# EAGLE design pecl_pulse_driver (EAGLE 9.2.2)
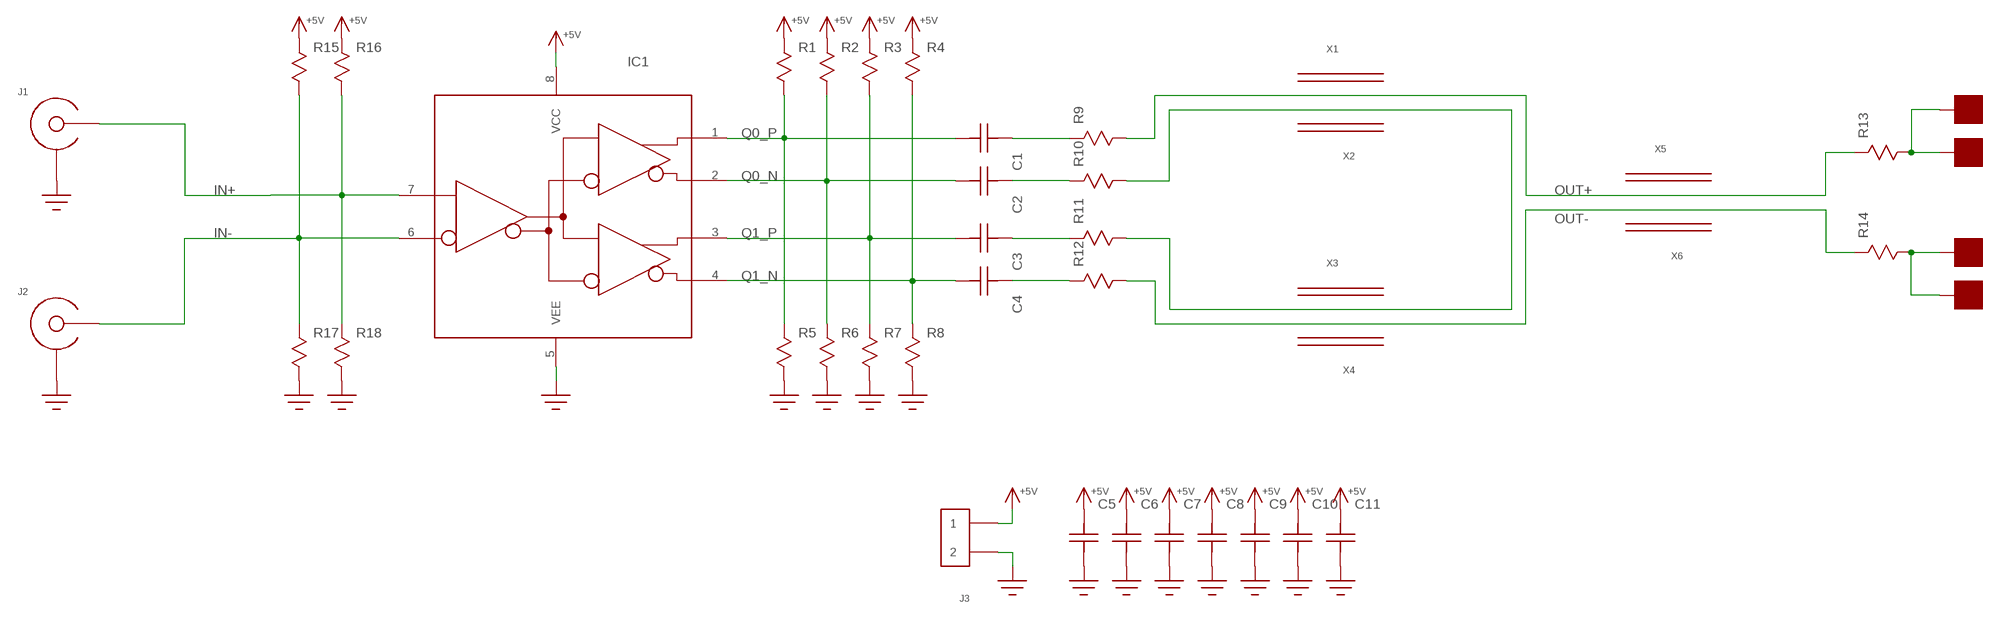
[diagram p0: schematic, sheet 1]

## Parts
C1  C0603  [C0603]
C2  C0603  [C0603]
C3  C0603  [C0603]
C4  C0603  [C0603]
C5  C0603  [C0603]
C6  C0603  [C0603]
C7  C0805  [0805]
C8  C0603  [C0603]
C9  C0603  [C0603]
C10  C0603  [C0603]
C11  C0603  [C0603]
IC1  SY10EP89V  [SOIC8]
J1  EDGE_LAUNCH_JACK  [EDGE_LAUNCH_RF_CON]
J2  EDGE_LAUNCH_JACK  [EDGE_LAUNCH_RF_CON]
J3  HEADER_2PIN  [HEADER_2PIN]
R1  R0603  [R0603]
R2  R0603  [R0603]
R3  R0603  [R0603]
R4  R0603  [R0603]
R5  R0603  [R0603]
R6  R0603  [R0603]
R7  R0603  [R0603]
R8  R0603  [R0603]
R9  R0603  [R0603]
R10  R0603  [R0603]
R11  R0603  [R0603]
R12  R0603  [R0603]
R13  R0603  [R0603]
R14  R0603  [R0603]
R15  R0603  [R0603]
R16  R0603  [R0603]
R17  R0603  [R0603]
R18  R0603  [R0603]
U$4  PAD50MIL  [PAD_50MIL]
U$5  PAD50MIL  [PAD_50MIL]
U$35  PAD50MIL  [PAD_50MIL]
U$36  PAD50MIL  [PAD_50MIL]
X1  FERRITE_PLATE  [FERRITE-MP0350]
X2  FERRITE_PLATE  [FERRITE-MP0350]
X3  FERRITE_PLATE  [FERRITE-MP0350]
X4  FERRITE_PLATE  [FERRITE-MP0350]
X5  FERRITE_PLATE  [FERRITE-MP0350]
X6  FERRITE_PLATE  [FERRITE-MP0350]

## Nets
+5V: C5.P$2 C6.P$2 C7.P$2 C8.P$2 C9.P$2 C10.P$2 C11.P$2 IC1.8(VCC) J3.1 R1.P$1 R2.P$1 R3.P$1 R4.P$1 R15.P$1 R16.P$1
GND: C5.P$1 C6.P$1 C7.P$1 C8.P$1 C9.P$1 C10.P$1 C11.P$1 IC1.5(VEE) J1.GND@1(SHIELD) J1.GND@2(SHIELD) J1.GND@3(SHIELD) J1.GND@4(SHIELD) J1.GND@5(SHIELD) J1.GND@6(SHIELD) J1.GND@7(SHIELD) J1.GND@8(SHIELD) J1.GND@9(SHIELD) J1.GND@10(SHIELD) J1.GND@11(SHIELD) J1.GND@12(SHIELD) J1.SHIELD@1(SHIELD) J1.SHIELD@2(SHIELD) J2.GND@1(SHIELD) J2.GND@2(SHIELD) J2.GND@3(SHIELD) J2.GND@4(SHIELD) J2.GND@5(SHIELD) J2.GND@6(SHIELD) J2.GND@7(SHIELD) J2.GND@8(SHIELD) J2.GND@9(SHIELD) J2.GND@10(SHIELD) J2.GND@11(SHIELD) J2.GND@12(SHIELD) J2.SHIELD@1(SHIELD) J2.SHIELD@2(SHIELD) J3.2 R5.P$2 R6.P$2 R7.P$2 R8.P$2 R17.P$2 R18.P$2
IN+: IC1.7(D) J1.CENTER R16.P$2 R18.P$1
IN-: IC1.6(!D!) J2.CENTER R15.P$2 R17.P$1
N$7: C1.P$2 R9.P$1
N$8: C2.P$2 R10.P$1
N$9: C3.P$2 R11.P$1
N$10: C4.P$2 R12.P$1
N$12: R10.P$2 R11.P$2
N$15: R13.P$2 U$4.P$1 U$35.P$1
N$16: R14.P$2 U$5.P$1 U$36.P$1
OUT+: R9.P$2 R13.P$1
OUT-: R12.P$2 R14.P$1
Q0_N: C2.P$1 IC1.2(!Q0!) R2.P$2 R6.P$1
Q0_P: C1.P$1 IC1.1(Q0) R1.P$2 R5.P$1
Q1_N: C4.P$1 IC1.4(!Q1!) R4.P$2 R8.P$1
Q1_P: C3.P$1 IC1.3(Q1) R3.P$2 R7.P$1

## Library data of the parts
C1-C11 = yapo:C
IC1 = yapo:SY10EP89V
J1 J2 = yapo:EDGE_LAUNCH_JACK
J3 = yapo:HEADER_2PIN
R1-R18 = yapo:R
U$4 U$5 U$35 U$36 = yapo:PAD
X1-X6 = yapo:FERRITE_PLATE

## Net classes
1 100_ohm_diff: width 0.711 mm, clearance 0.152 mm

## Board
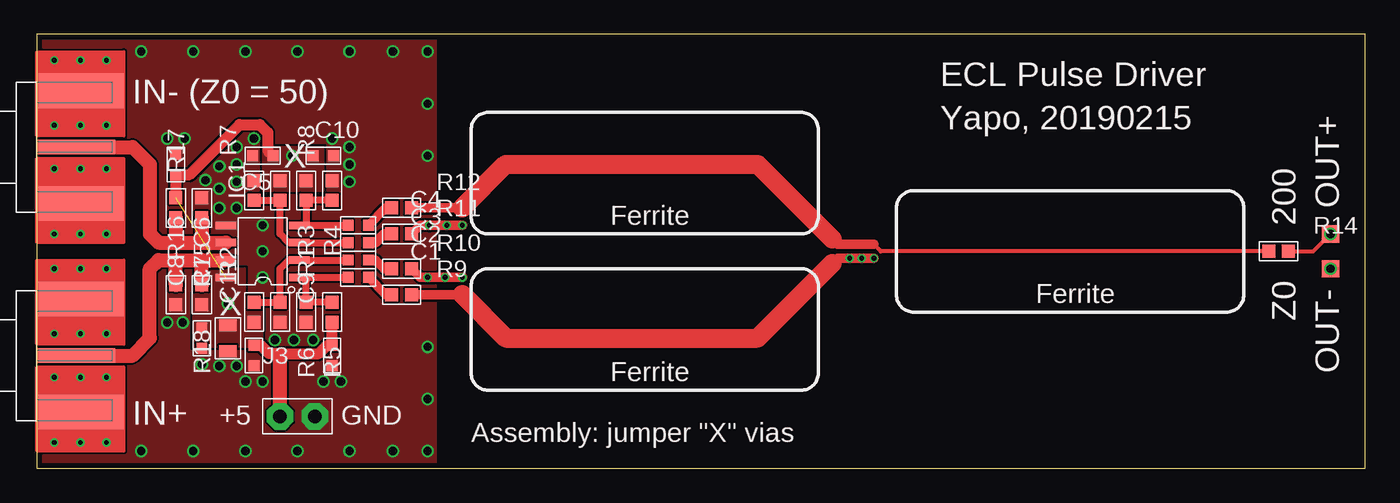
[diagram p1: board, top side]
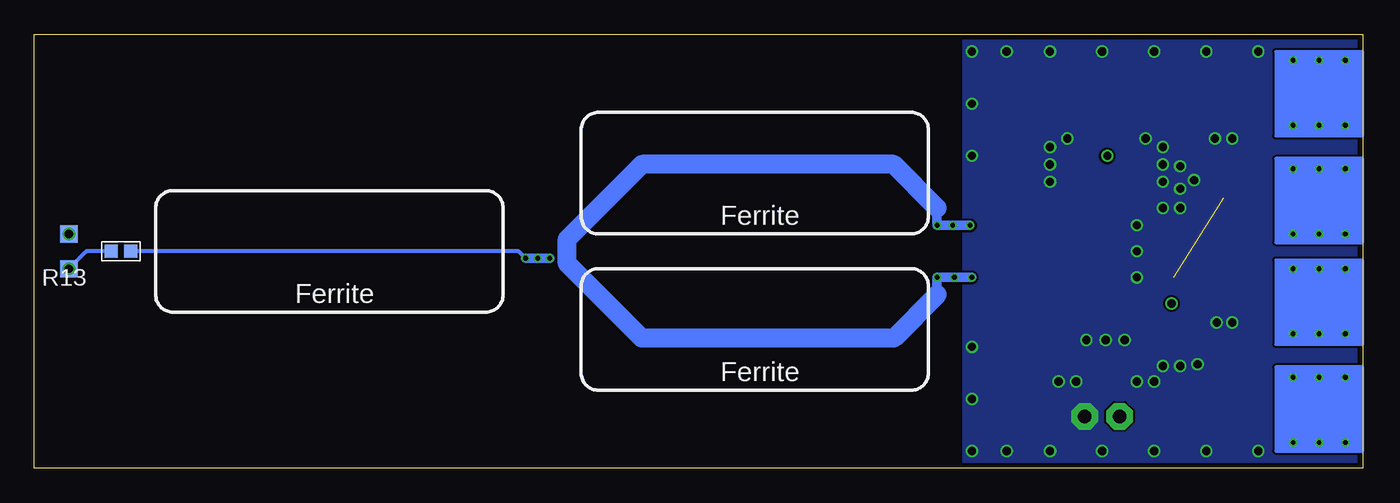
[diagram p2: board, bottom side, seen from below]

Size 97.16 x 31.75 mm. Coordinates in mm from the lower left corner, seen from the top.
Outline: 0,0 97.14,0 97.16,31.75 0,31.75 0,0
Copper layers (1*16): Top 0.035559375mm / dielectric 1.6mm / Bottom 0.035559375mm
Design rules "oshpark-2layer *": minimum track width 6mil, minimum drill 10mil, track to track 6mil, track to pad 6mil, pad to pad 6mil, via to via 6mil, smd to smd 6mil, copper to edge 15mil, drill to drill 6mil, minimum pad ring 5mil, minimum via ring 5mil, stop-mask expansion 2.5mil, vias tented up to drill 30mil, thermal gap 10mil

### Footprints (pad centres in the part's own frame; a part is rotated, then mirrored left to right if it is on the bottom)
C0603 = smd 0.8 x 0.8: P$1 -0.75,0; P$2 0.75,0
0805 = smd 0.9 x 1.3: P$1 -0.95,0; P$2 0.95,0
SOIC8 = smd 0.55 x 1.5: 1 -1.905,-2.7; 2 -0.635,-2.7; 3 0.635,-2.7; 4 1.905,-2.7; 5 1.905,2.7; 6 0.635,2.7; 7 -0.635,2.7; 8 -1.905,2.7
EDGE_LAUNCH_RF_CON = smd 5.715 x 1.041: CENTER -2.875,0 | drill 0.35: GND@1 -5.08,1.587; GND@2 -3.175,1.587; GND@3 -1.27,1.587; GND@4 -5.08,-1.587; GND@5 -3.175,-1.587; GND@6 -1.27,-1.587; GND@7 -5.08,6.35; GND@8 -3.175,6.35; GND@9 -1.27,6.35; GND@10 -5.08,-6.35; GND@11 -3.175,-6.35; GND@12 -1.27,-6.35 | smd 6.35 x 2.54: SHIELD@1 -3.175,-4.128; SHIELD@2 -3.175,4.128
HEADER_2PIN = drill 1 pad 1.93 octagon: 1 -1.27,0; 2 1.27,0
R0603 = smd 0.95 x 0.95: P$1 -0.725,0; P$2 0.725,0
PAD_50MIL = smd 1.27 x 1.27: P$1 0,0

### Placement (x,y rotation side)
C1  23.5,13.97 0 top
C2  23.5,15.24 0 top
C3  23.5,16.51 0 top
C4  23.5,17.78 0 top
C5  20.95,22.86 180 top
C6  10.16,22.23 270 top
C7  13.97,9.53 90 top
C8  12.06,9.53 90 top
C9  21.59,8.26 90 top
C10  16.51,22.86 0 top
C11  15.88,8.26 90 top
IC1  16.51,15.88 90 top
J1  0,8.26 180 top
J2  0,23.5 180 top
J3  19.05,3.81 0 top
R1  21.59,11.43 90 top
R2  15.88,11.43 90 top
R3  17.78,20.32 270 top
R4  19.68,20.32 270 top
R5  19.68,11.43 270 top
R6  17.78,11.43 270 top
R7  15.88,20.32 90 top
R8  21.59,20.32 90 top
R9  26.67,12.7 0 top
R10  26.67,14.61 0 top
R11  26.67,17.14 0 top
R12  26.67,19.05 0 top
R13  90.81,15.88 180 bottom
R14  90.81,15.88 0 top
R15  10.16,19.05 270 top
R16  12.06,12.7 90 top
R17  12.06,19.05 90 top
R18  10.16,12.7 270 top
U$4  94.61,14.61 0 bottom
U$5  94.61,17.14 0 top
U$35  94.61,14.61 0 top
U$36  94.61,17.14 0 bottom
X1  75.56,15.88 0 top
X2  75.56,15.88 0 bottom
X3  44.45,10.16 0 top
X4  44.45,10.16 0 bottom
X5  44.45,21.59 0 top
X6  44.45,21.59 0 bottom

### Tracks (layer width: path | path; a pad name or v marks a point on that pad's centre or on a via)
+5V  (via drill 0.6)  (1 unrouted)
  Top 0.813: R1.P$1 C9.P$2 21.23,9.01 20.61,8.39 17.68,8.39 | R15.P$1 C6.P$2 11.16,21.48 14.82,25.14 16.29,25.14 16.88,24.55 16.88,23.24 C10.P$2 | C11.P$2 16.36,9.01 16.98,8.39 17.68,8.39 | 17.78,8.29 17.68,8.39
  Top 1.016: J3.1 17.78,8.29
  other vias: 13.97,12.06 18.67,22.86
  pour Top (no thermals): 12.7,13.97 12.7,12.7 11.43,12.7 11.43,8.89 16.51,8.89 16.51,11.43 15.24,11.43 15.24,14.61 12.7,14.61
  pour Top (no thermals): 17.14,20.32 20.95,20.32 20.95,23.5 16.51,23.5 16.51,20.32
GND  (via drill 0.6)
  other vias: 7.62,30.48 11.43,30.48 15.24,30.48 19.05,30.48 22.86,30.48 28.57,30.48 28.57,1.27 22.86,1.27 19.05,1.27 15.24,1.27 11.43,1.27 7.62,1.27 28.57,26.67 28.57,22.86 28.57,5.08 28.57,8.89 26.04,30.48 26.04,1.27 20.95,6.35 22.23,6.35 15.24,6.35 16.51,6.35 14.61,7.49 12.06,7.62 9.53,10.67 10.67,10.67 12.32,21.08 13.34,20.45 9.53,24.13 10.79,24.13 14.61,20.95 14.61,22.23 14.61,23.5 22.86,23.5 22.86,22.23 22.86,20.95 17.4,9.4 18.8,9.4 20.19,9.4 14.61,19.05 13.34,19.05 16.51,17.78 16.51,15.88 16.51,13.97 13.34,7.49 15.88,24.13 21.59,24.13 13.34,22.1
  pour Top (rank 2, no thermals): 0,0 29.21,0 29.21,31.75 0,31.75
  pour Bottom (no thermals): 0,0 29.21,0 29.21,31.75 0,31.75
IN+
  Top 1.016: J1.CENTER 6.99,8.26 8.26,9.53 8.26,14.61 8.89,15.24 10.16,15.24 | 10.16,15.24 12.06,15.24 | 12.06,15.24 IC1.7 | R18.P$1 10.16,15.24 | R16.P$2 12.06,15.24
IN-
  Top 1.016: J2.CENTER 6.99,23.5 8.26,22.23 8.26,17.14 8.89,16.51 10.16,16.51 | 10.16,16.51 12.06,16.51 | 12.06,16.51 IC1.6 | R15.P$2 10.16,16.51 | R17.P$1 12.06,16.51
N$7
  Top 0.711: C1.P$2 25.52,12.7 R9.P$1
N$8
  Top 0.711: C2.P$2 24.77,15.24 25.4,14.61 R10.P$1
N$9
  Top 0.711: C3.P$2 24.77,16.51 25.4,17.14 R11.P$1
N$10
  Top 0.711: C4.P$2 25.52,19.05 R12.P$1
N$12  (via drill 0.35)
  Top 0.711: R11.P$2 28.03,17.78 v28.7,17.78 v29.97,17.78 v31.11,17.78 | R10.P$2 28.03,13.97 v31.11,13.97
  Bottom 0.711: v28.7,17.78 v31.11,17.78 31.11,19.05 | v31.11,13.97 31.11,12.7 | v31.11,13.97 v28.57,13.97 | v29.84,13.97 v31.11,13.97
  Bottom 1.397: 31.11,19.05 34.29,22.23 52.7,22.23 58.17,16.76 58.17,14.99 52.7,9.53 34.29,9.53 31.11,12.7
N$15  (via drill 0.6)
  Bottom 0.292: R13.P$2 93.34,15.88 U$35.P$1
  other vias: 94.61,14.61
N$16  (via drill 0.6)
  Top 0.292: R14.P$2 93.34,15.88 U$36.P$1
  other vias: 94.61,17.14
OUT+  (via drill 0.35)
  Top 0.711: R9.P$2 31.11,12.7 | 58.17,14.99 58.55,15.37 v61.21,15.37
  Top 1.397: 31.11,12.7 34.29,9.53 52.7,9.53 58.17,14.99
  Bottom 0.292: v61.21,15.37 61.72,15.88 R13.P$1
  Bottom 0.711: v59.44,15.37 v60.33,15.37 v61.21,15.37
OUT-
  Top 0.292: 61.21,16.38 61.72,15.88 R14.P$1
  Top 0.711: R12.P$2 31.11,19.05 | 58.17,16.76 58.55,16.38 61.21,16.38
  Top 1.397: 31.11,19.05 34.29,22.23 52.7,22.23 58.17,16.76
Q0_N
  Top 0.508: C2.P$1 IC1.2 18.41,15.24 17.78,14.61 R6.P$1 R2.P$2
Q0_P
  Top 0.508: 19.68,13.97 C1.P$1 | 19.68,13.97 R5.P$1 R1.P$2 | 19.68,13.97 IC1.1
Q1_N
  Top 0.508: 19.68,17.78 C4.P$1 | 19.68,17.78 R4.P$2 R8.P$1 | 19.68,17.78 IC1.4
Q1_P
  Top 0.508: C3.P$1 IC1.3 18.41,16.51 17.78,17.14 R3.P$2 R7.P$1

### Text on the board
tPlace: ECL Pulse Driver | IN- (Z0 = 50) | Yapo, 20190215 | X | OUT+ | 200 | X | Z0 | OUT- | IN+ | +5 | GND | Assembly: jumper "X" vias